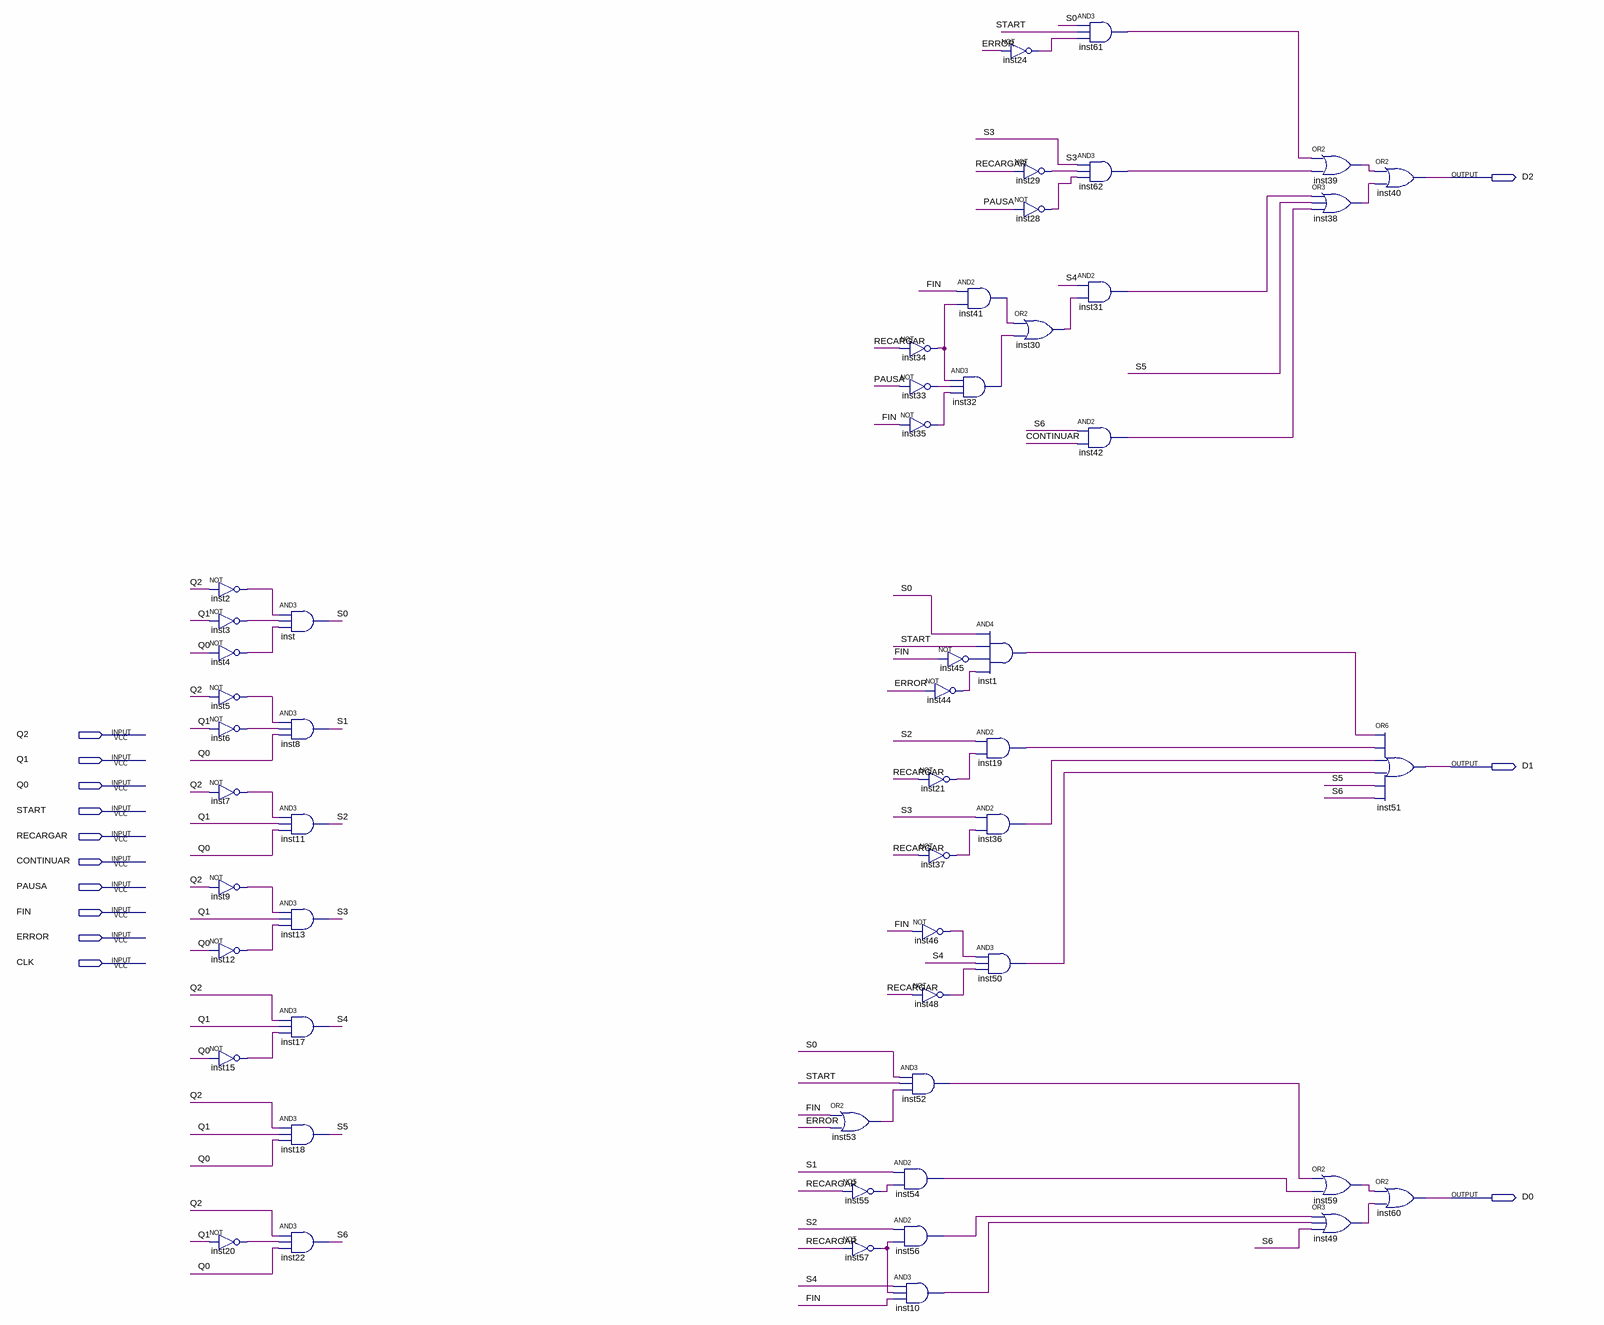
[diagram p0: schematic sheet]
// Quartus schematic MEF_funcion_de_estado.bdf as structural Verilog: 54 symbols, 13 pins
module MEF_funcion_de_estado (
  input  Q2,
  input  Q1,
  input  Q0,
  input  START,
  input  RECARGAR,
  input  CONTINUAR,
  input  PAUSA,
  input  FIN,
  input  ERROR,
  input  CLK,
  output D2,
  output D1,
  output D0
);

  wire inst1_out, inst2_out, inst3_out, inst4_out, inst5_out, inst6_out, inst7_out, inst9_out, inst10_out,
       inst12_out, inst15_out, inst19_out, inst20_out, inst21_out, inst24_out, inst28_out, inst29_out,
       inst30_out, inst31_out, inst32_out, inst33_out, inst34_out, inst35_out, inst36_out, inst37_out,
       inst38_out, inst39_out, inst41_out, inst42_out, inst44_out, inst45_out, inst46_out, inst48_out,
       inst49_out, inst50_out, inst52_out, inst53_out, inst54_out, inst55_out, inst56_out, inst57_out,
       inst59_out, inst61_out, inst62_out, S0, S1, S2, S3, S4, S5, S6;

  not inst2 (inst2_out, Q2);
  not inst3 (inst3_out, Q1);
  not inst4 (inst4_out, Q0);
  not inst5 (inst5_out, Q2);
  not inst6 (inst6_out, Q1);
  not inst7 (inst7_out, Q2);
  not inst9 (inst9_out, Q2);
  not inst12 (inst12_out, Q0);
  not inst15 (inst15_out, Q0);
  not inst20 (inst20_out, Q1);
  and inst (S0, inst2_out, inst3_out, inst4_out);
  and inst8 (S1, inst5_out, inst6_out, Q0);
  and inst11 (S2, inst7_out, Q1, Q0);
  and inst13 (S3, inst9_out, Q1, inst12_out);
  and inst17 (S4, Q2, Q1, inst15_out);
  and inst18 (S5, Q2, Q1, Q0);
  and inst22 (S6, Q2, inst20_out, Q0);
  or inst53 (inst53_out, FIN, ERROR);
  not inst55 (inst55_out, RECARGAR);
  not inst57 (inst57_out, RECARGAR);
  not inst34 (inst34_out, RECARGAR);
  not inst33 (inst33_out, PAUSA);
  not inst35 (inst35_out, FIN);
  not inst45 (inst45_out, FIN);
  not inst44 (inst44_out, ERROR);
  not inst21 (inst21_out, RECARGAR);
  not inst37 (inst37_out, RECARGAR);
  not inst46 (inst46_out, FIN);
  not inst48 (inst48_out, RECARGAR);
  and inst52 (inst52_out, S0, START, inst53_out);
  and inst54 (inst54_out, S1, inst55_out);
  and inst56 (inst56_out, S2, inst57_out);
  and inst10 (inst10_out, S4, inst57_out, FIN);
  and inst41 (inst41_out, FIN, inst34_out);
  and inst32 (inst32_out, inst34_out, inst33_out, inst35_out);
  and inst1 (inst1_out, S0, START, inst45_out, inst44_out);
  and inst19 (inst19_out, S2, inst21_out);
  and inst36 (inst36_out, S3, inst37_out);
  and inst50 (inst50_out, inst46_out, S4, inst48_out);
  not inst24 (inst24_out, ERROR);
  not inst29 (inst29_out, RECARGAR);
  not inst28 (inst28_out, PAUSA);
  or inst30 (inst30_out, inst41_out, inst32_out);
  and inst61 (inst61_out, S0, START, inst24_out);
  and inst62 (inst62_out, S3, inst29_out, inst28_out);
  and inst31 (inst31_out, S4, inst30_out);
  and inst42 (inst42_out, S6, CONTINUAR);
  or inst39 (inst39_out, inst61_out, inst62_out);
  or inst38 (inst38_out, inst31_out, S5, inst42_out);
  or inst59 (inst59_out, inst52_out, inst54_out);
  or inst49 (inst49_out, inst56_out, inst10_out, S6);
  or inst40 (D2, inst39_out, inst38_out);
  or inst51 (D1, inst1_out, inst19_out, inst36_out, inst50_out, S5, S6);
  or inst60 (D0, inst59_out, inst49_out);
endmodule
